# Altium schematic sheet 20 PCIE BRIDGE POWER.SchDoc
size 420 x 297 mm
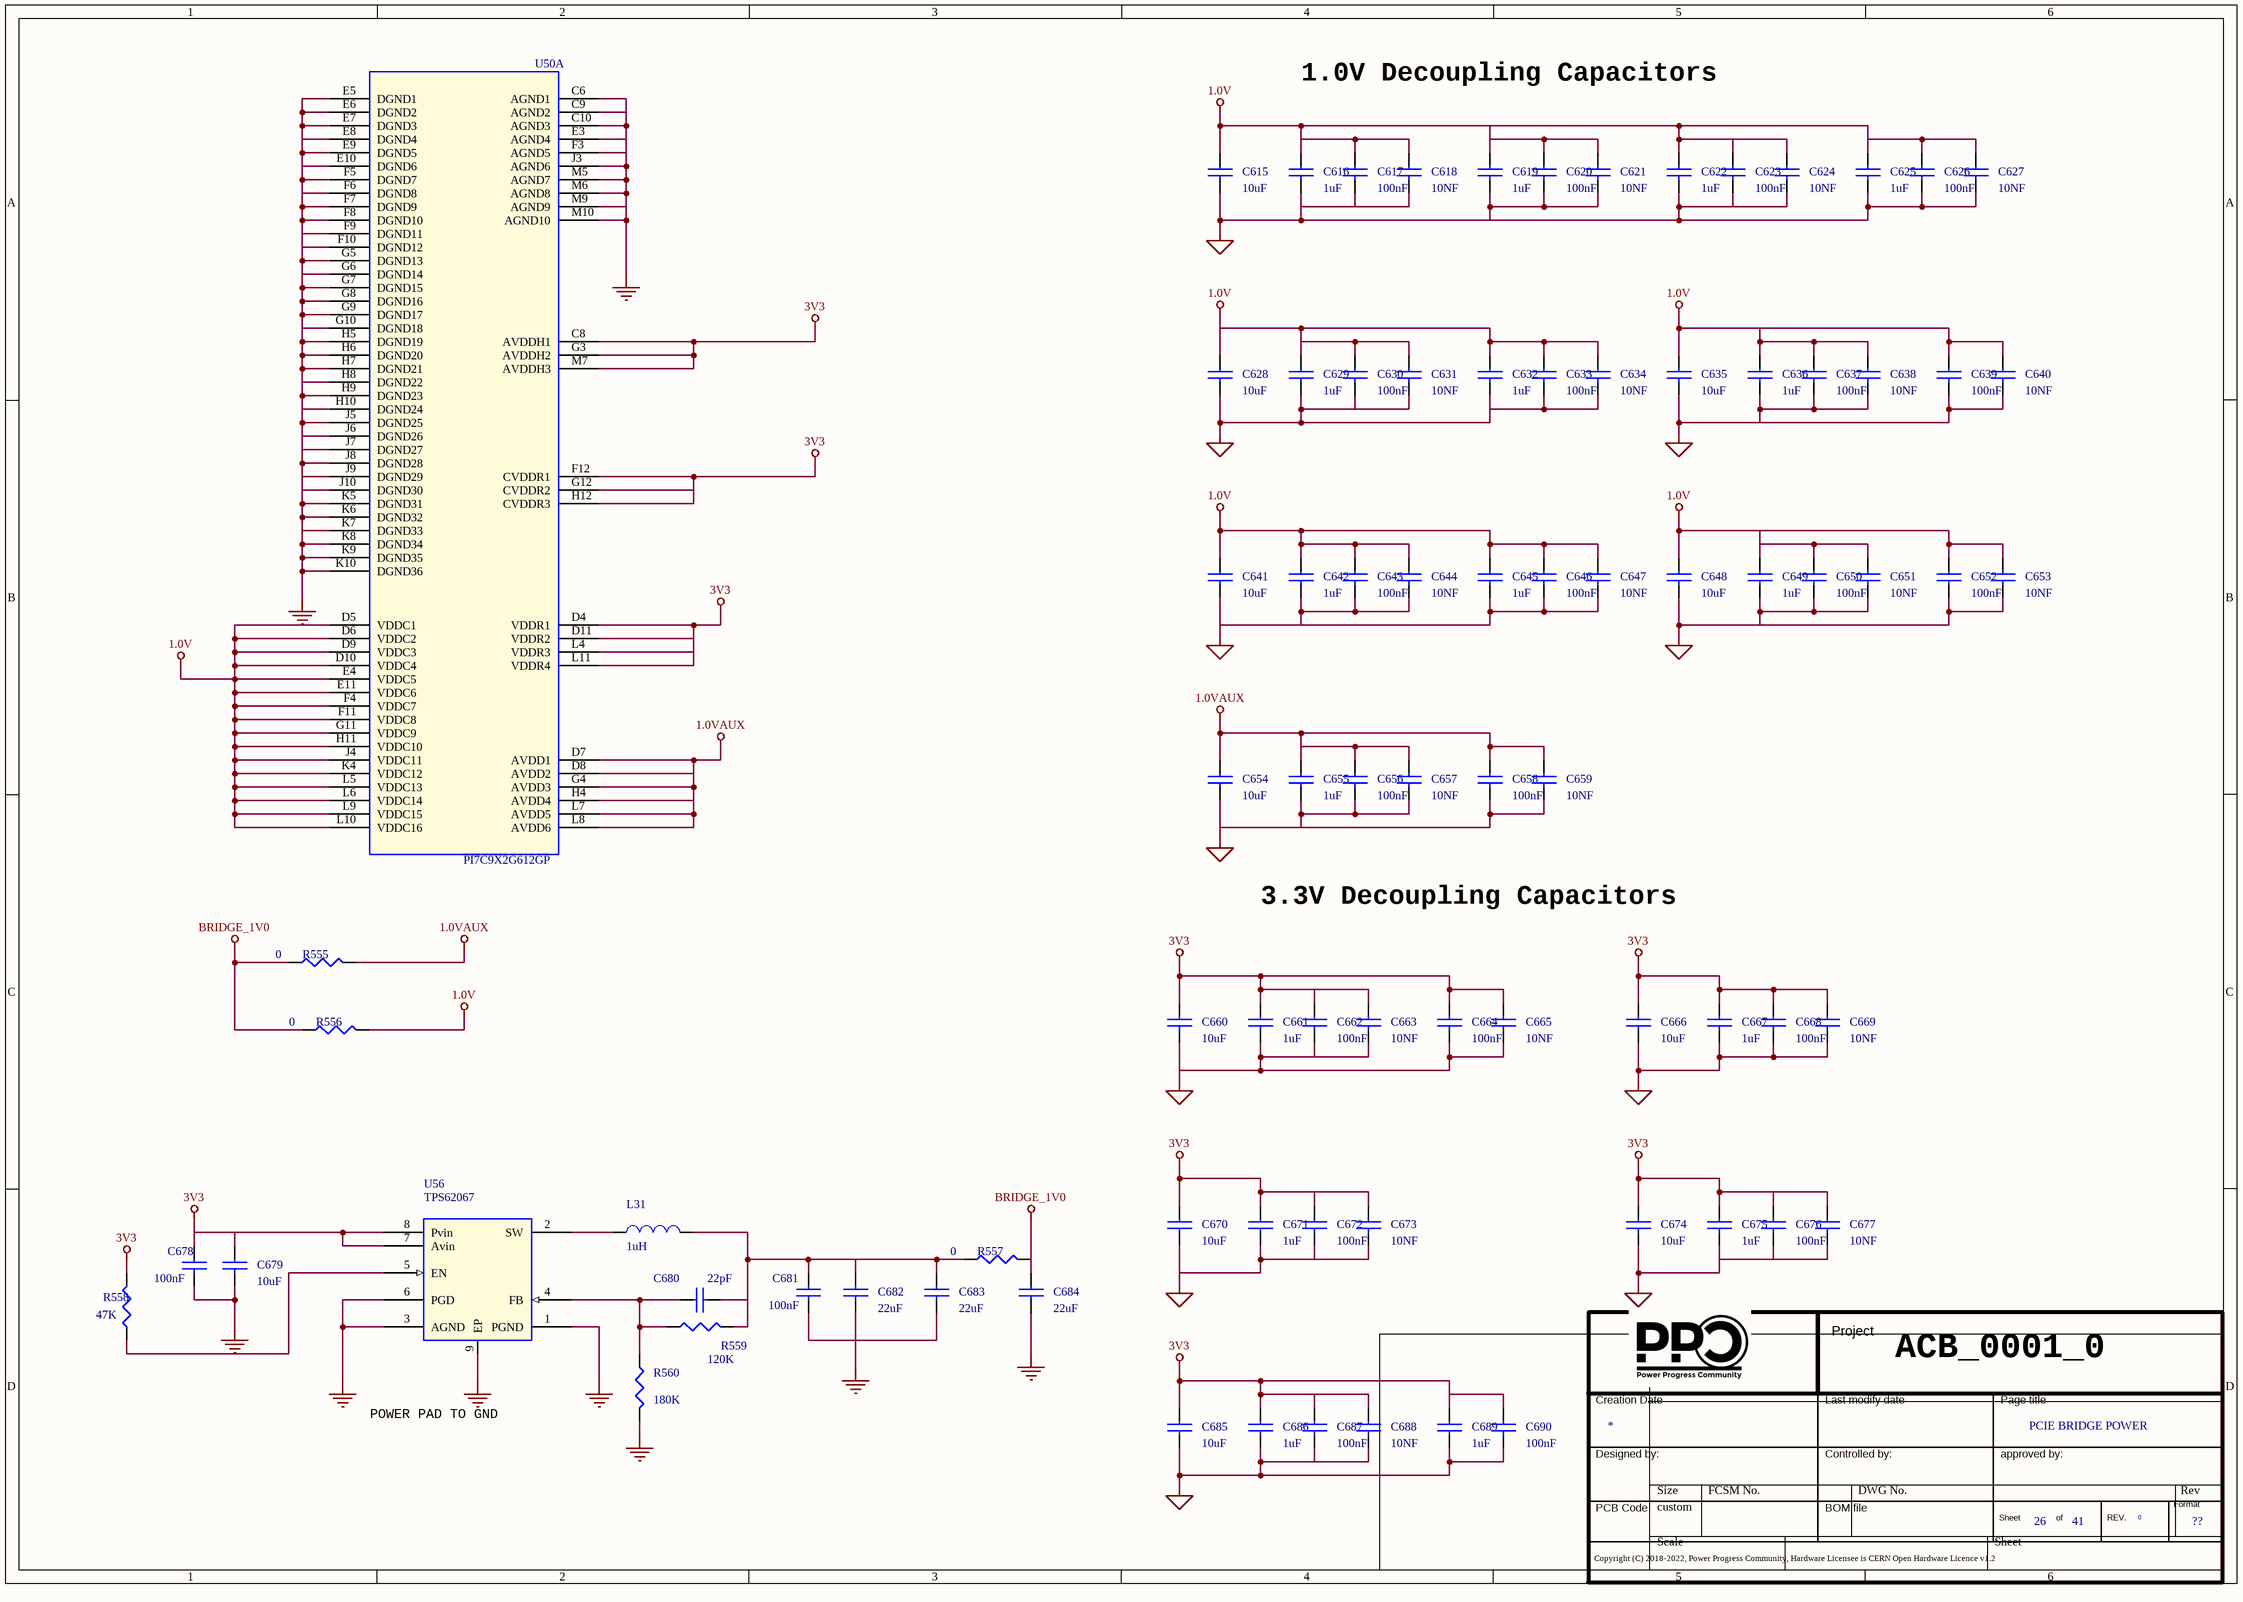
[diagram p0: 20 PCIE BRIDGE POWER.SchDoc]

## Parts
*  Doc: PCIE BRIDGE POWER  Page Count: 41  Page Number: 26  Page Size: ??  RevCode: 0  (hidden comment: Title_block_PPC)  (graphical)
C615  10uF  [SMD_0603]
C616  1uF  [SMD_0402]
C617  100nF  [SMD_0201]
C618  10NF  [SMD_0402]
C619  1uF  [SMD_0402]
C620  100nF  [SMD_0201]
C621  10NF  [SMD_0402]
C622  1uF  [SMD_0402]
C623  100nF  [SMD_0201]
C624  10NF  [SMD_0402]
C625  1uF  [SMD_0402]
C626  100nF  [SMD_0201]
C627  10NF  [SMD_0402]
C628  10uF  [SMD_0603]
C629  1uF  [SMD_0402]
C630  100nF  [SMD_0201]
C631  10NF  [SMD_0402]
C632  1uF  [SMD_0402]
C633  100nF  [SMD_0201]
C634  10NF  [SMD_0402]
C635  10uF  [SMD_0603]
C636  1uF  [SMD_0402]
C637  100nF  [SMD_0201]
C638  10NF  [SMD_0402]
C639  100nF  [SMD_0201]
C640  10NF  [SMD_0402]
C641  10uF  [SMD_0603]
C642  1uF  [SMD_0402]
C643  100nF  [SMD_0201]
C644  10NF  [SMD_0402]
C645  1uF  [SMD_0402]
C646  100nF  [SMD_0201]
C647  10NF  [SMD_0402]
C648  10uF  [SMD_0603]
C649  1uF  [SMD_0402]
C650  100nF  [SMD_0201]
C651  10NF  [SMD_0402]
C652  100nF  [SMD_0201]
C653  10NF  [SMD_0402]
C654  10uF  [SMD_0603]
C655  1uF  [SMD_0402]
C656  100nF  [SMD_0201]
C657  10NF  [SMD_0402]
C658  100nF  [SMD_0201]
C659  10NF  [SMD_0402]
C660  10uF  [SMD_0603]
C661  1uF  [SMD_0402]
C662  100nF  [SMD_0201]
C663  10NF  [SMD_0402]
C664  100nF  [SMD_0201]
C665  10NF  [SMD_0402]
C666  10uF  [SMD_0603]
C667  1uF  [SMD_0402]
C668  100nF  [SMD_0201]
C669  10NF  [SMD_0402]
C670  10uF  [SMD_0603]
C671  1uF  [SMD_0402]
C672  100nF  [SMD_0201]
C673  10NF  [SMD_0402]
C674  10uF  [SMD_0603]
C675  1uF  [SMD_0402]
C676  100nF  [SMD_0201]
C677  10NF  [SMD_0402]
C678  100nF  [SMD_0402]
C679  10uF  [SMD_0603]
C680  22pF  [SMD_0402]
C681  100nF  [SMD_0402]
C682  22uF  [SMD_0805]
C683  22uF  [SMD_0805]
C684  22uF  [SMD_0805]
C685  10uF  [SMD_0603]
C686  1uF  [SMD_0402]
C687  100nF  [SMD_0201]
C688  10NF  [SMD_0402]
C689  1uF  [SMD_0402]
C690  100nF  [SMD_0201]
L31  1uH  [Ind_2016]
R555  0  [SMD_0402]
R556  0  [SMD_0402]
R557  0  [SMD_0402]
R558  47K  [SMD_0402]
R559  120K  [SMD_0402]
R560  180K  [SMD_0402]
U50  PI7C9X2G612GP  [LQFP]  (part A of 3)
U56  TPS62067  [WSON8]

## Nets
1.0V: C615.1 C616.1 C617.1 C618.1 C619.1 C620.1 C621.1 C622.1 C623.1 C624.1 C625.1 C626.1 C627.1 C628.1 C629.1 C630.1 C631.1 C632.1 C633.1 C634.1 C635.1 C636.1 C637.1 C638.1 C639.1 C640.1 C641.1 C642.1 C643.1 C644.1 C645.1 C646.1 C647.1 C648.1 C649.1 C650.1 C651.1 C652.1 C653.1 R556.2 U50.D5(VDDC1) U50.D6(VDDC2) U50.D9(VDDC3) U50.D10(VDDC4) U50.E4(VDDC5) U50.E11(VDDC6) U50.F4(VDDC7) U50.F11(VDDC8) U50.G11(VDDC9) U50.H11(VDDC10) U50.J4(VDDC11) U50.K4(VDDC12) U50.L5(VDDC13) U50.L6(VDDC14) U50.L9(VDDC15) U50.L10(VDDC16)
1.0VAUX: C654.1 C655.1 C656.1 C657.1 C658.1 C659.1 R555.2 U50.D7(AVDD1) U50.D8(AVDD2) U50.G4(AVDD3) U50.H4(AVDD4) U50.L7(AVDD5) U50.L8(AVDD6)
3V3: C660.1 C661.1 C662.1 C663.1 C664.1 C665.1 C666.1 C667.1 C668.1 C669.1 C670.1 C671.1 C672.1 C673.1 C674.1 C675.1 C676.1 C677.1 C678.1 C679.1 C685.1 C686.1 C687.1 C688.1 C689.1 C690.1 R558.1 U50.C8(AVDDH1) U50.D4(VDDR1) U50.D11(VDDR2) U50.F12(CVDDR1) U50.G3(AVDDH2) U50.G12(CVDDR2) U50.H12(CVDDR3) U50.L4(VDDR3) U50.L11(VDDR4) U50.M7(AVDDH3) U56.7(Avin) U56.8(Pvin)
BRIDGE_1V0: C684.1 R555.1 R556.1 R557.2
GND: C615.2 C616.2 C617.2 C618.2 C619.2 C620.2 C621.2 C622.2 C623.2 C624.2 C625.2 C626.2 C627.2 C628.2 C629.2 C630.2 C631.2 C632.2 C633.2 C634.2 C635.2 C636.2 C637.2 C638.2 C639.2 C640.2 C641.2 C642.2 C643.2 C644.2 C645.2 C646.2 C647.2 C648.2 C649.2 C650.2 C651.2 C652.2 C653.2 C654.2 C655.2 C656.2 C657.2 C658.2 C659.2 C660.2 C661.2 C662.2 C663.2 C664.2 C665.2 C666.2 C667.2 C668.2 C669.2 C670.2 C671.2 C672.2 C673.2 C674.2 C675.2 C676.2 C677.2 C678.2 C679.2 C681.2 C682.2 C683.2 C684.2 C685.2 C686.2 C687.2 C688.2 C689.2 C690.2 R560.2 U50.C6(AGND1) U50.C9(AGND2) U50.C10(AGND3) U50.E3(AGND4) U50.E5(DGND1) U50.E6(DGND2) U50.E7(DGND3) U50.E8(DGND4) U50.E9(DGND5) U50.E10(DGND6) U50.F3(AGND5) U50.F5(DGND7) U50.F6(DGND8) U50.F7(DGND9) U50.F8(DGND10) U50.F9(DGND11) U50.F10(DGND12) U50.G5(DGND13) U50.G6(DGND14) U50.G7(DGND15) U50.G8(DGND16) U50.G9(DGND17) U50.G10(DGND18) U50.H5(DGND19) U50.H6(DGND20) U50.H7(DGND21) U50.H8(DGND22) U50.H9(DGND23) U50.H10(DGND24) U50.J3(AGND6) U50.J5(DGND25) U50.J6(DGND26) U50.J7(DGND27) U50.J8(DGND28) U50.J9(DGND29) U50.J10(DGND30) U50.K5(DGND31) U50.K6(DGND32) U50.K7(DGND33) U50.K8(DGND34) U50.K9(DGND35) U50.K10(DGND36) U50.M5(AGND7) U50.M6(AGND8) U50.M9(AGND9) U50.M10(AGND10) U56.1(PGND) U56.3(AGND) U56.6(PGD) U56.9(EP)
NetC680_1: C680.1 R559.1 R560.1 U56.4(FB)
NetC680_2: C680.2 C681.1 C682.1 C683.1 L31.2 R557.1 R559.2
NetL31_1: L31.1 U56.2(SW)
NetR558_2: R558.2 U56.5(EN)

## Notes on the sheet
- 1.0V Decoupling Capacitors
- 3.3V Decoupling Capacitors
- ACB_0001_0
- POWER PAD TO GND
- (in symbol Title_block_PPC) Project; Creation Date; Last modify date; Page title; Designed by:; Controlled by:; approved by:; Format; PCB Code; BOM file; Sheet; of; REV.; Copyright (C) 2018-2022, Power Progress Community, Hardware Licensee is CERN Open Hardware Licence v1.2

## Library data of the parts
* = Title_block_PPC: Title: T2080PCIe; Author: MICETEK; Page Create Date: March  8, 1995; Page Title: ?; Page Modify Date: *
C615 C628 C635 C641 C648 C654 C660 C666 C670 C674 C685 = CAP NP_Dup3: COND.CER.10uF 0603 25V SMD; Manufacturer Part Number 1: CL10A106MA8NRNC; Manufacturer 1: SAMSUNG; Part Number: PASSIVE_124; RSM: RC0603; PCB Footprint: SMD_0603; Part Type: Capacitors\Ceramic\SMD\0603
C616 C619 C622 C625 C629 C632 C636 C642 C645 C649 C655 C661 C667 C671 C675 C686 C689 = CAP NP_Dup3: CAP CER 1UF 25V X6S 0402; Manufacturer Part Number 1: GRM155C81E105KE11D; Manufacturer 1: Murata; Part Number: PASSIVE_1446; RSM: RC0402; PCB Footprint: SMD_0402; Part Type: Capacitors\Ceramic\SMD\0402
C617 C620 C623 C626 C630 C633 C637 C639 C643 C646 C650 C652 C656 C658 C662 C664 C668 C672 C676 C687 C690 = CAP NP_Dup3: CAP CER 0.1UF 6.3V 20% X5R 0201; Part Number: PASSIVE_3; Manufacturer 1: TDK; Manufacturer Part Number 1: C0603X5R0J104M030BC; RSM: RC0201; Part Type: Capacitors\Ceramic\SMD\0201; PCB Footprint: SMD_0201
C618 C621 C624 C627 C631 C634 C638 C640 C644 C647 C651 C653 C657 C659 C663 C665 C669 C673 C677 C688 = CAP NP_Dup3: COND.CER. 10NF 16V 0402 X7R SMD; Part Number: PASSIVE_28; Manufacturer 1: AVX; Manufacturer Part Number 1: 0402YC103KAT2A; RSM: RC0402; Part Type: Capacitors\Ceramic\SMD\0402; PCB Footprint: SMD_0402
C678 = CAP NP_Dup10: COND.CER. 100NF 50V 0402 X7R SMD; LNK_PART: C0402X55; Part Number: PASSIVE_24; Manufacturer 1: TDK; Manufacturer Part Number 1: CGA2B3X7R1H104M050BD; Tecno77: RC0402; PCB Footprint: SMD_0402; Part Type: Capacitors\Ceramic\SMD\0402; Distributor 1: MURATA ELETTRONICA SPA; RSM: RC0402
C679 = CAP NP_Dup4: COND.CER.10uF 0603 25V SMD; Part Number: PASSIVE_124; Manufacturer 1: SAMSUNG; Manufacturer Part Number 1: CL10A106MA8NRNC; LNK_PART: GRM188R60J106ME47D; RSM: RC0603; PCB Footprint: SMD_0603; Part Type: Capacitors\Ceramic\SMD\0603; Distributor 1: MOUSER (81-GRM188R60J106ME47)
C680 = CAP NP_Dup10: COND.CER. 22PF 50V 0402 NPO 5% SMD; Part Number: PASSIVE_65; Manufacturer 1: Murata; Manufacturer Part Number 1: GRM1555C1H220JZ01; RSM: RC0402; PCB Footprint: SMD_0402; Part Type: Capacitors\Ceramic\SMD\0402; Distributor 1: MURATA ELETTRONICA SPA
C681 = CAP NP_Dup10: COND.CER. 100NF 50V 0402 X7R SMD; Manufacturer Part Number 1: CGA2B3X7R1H104M050BD; Manufacturer 1: TDK; Part Number: PASSIVE_24; LNK_PART: C0402X55; RSM: RC0402; PCB Footprint: SMD_0402; Tecno77: RC0402; Distributor 1: MURATA ELETTRONICA SPA; Part Type: Capacitors\Ceramic\SMD\0402
C682-C684 = CAP NP_Dup3: 22UF 35V 20% 0805; Manufacturer Part Number 1: C2012X5R1V226M125AC; Manufacturer 1: TDK; Part Number: PASSIVE_224; RSM: RC0805; PCB Footprint: SMD_0805; Part Type: Capacitors\Ceramic\SMD\0805
L31 = INDUCTOR: Induttori fissi 1.0uH 2.08A 68mOhms Pwr Circuit Inductor; Manufacturer Part Number 1: VLS201612CX-1R0M; Manufacturer 1: TDK; Part Number: PASSIVE_424; RSM: IND-TDK-VLS-2016; Distributor 1: MOUSER(810-VLS201612CX-1R0M  ); Part Type: Inductors\SMD; PCB Footprint: Ind_2016
R555 = R_Dup5: RESIS.CHIP 0R 5% 0402 SMD; LNK_PART: R0402X55; Manufacturer 1: ROYAL OHM; Part Number: PASSIVE_805; RSM: RC0402; PCB Footprint: SMD_0402; Distributor 1: CAMEL ELETTRONICA SRL  #; Manufacturer Part Number 1: RESIS.CHIP 0R 5% 0402 SMD; Part Type: Resistors\Fixed\SMD\0402\5%
R556 R557 = R_Dup5: RESIS.CHIP 0R 5% 0402 SMD; Part Number: PASSIVE_805; Manufacturer 1: ROYAL OHM; LNK_PART: R0402X55; RSM: RC0402; PCB Footprint: SMD_0402; Part Type: Resistors\Fixed\SMD\0402\5%; Manufacturer Part Number 1: RESIS.CHIP 0R 5% 0402 SMD; Distributor 1: CAMEL ELETTRONICA SRL  #
R558 = R_Dup5: RESIS.CHIP 47K 1% 0402 SMD; Part Number: PASSIVE_737; Manufacturer 1: ROYAL OHM; LNK_PART: R0402X55; Tecno77: RC0402; PCB Footprint: SMD_0402; Part Type: Resistors\Fixed\SMD\0402\1%; Manufacturer Part Number 1: RESIS.CHIP 47K 1% 0402 SMD; Distributor 1: CAMEL ELETTRONICA SRL  #; RSM: RC0402
R559 = R_Dup9: RESIS.CHIP 120K 1% 0402 SMD; Part Number: PASSIVE_593; Manufacturer 1: WALSIN; Manufacturer Part Number 1: WR04W1203FTL; RSM: RC0402; PCB Footprint: SMD_0402; Part Type: Resistors\Fixed\SMD\0402\1%; Distributor 1: MODULI ELETTRONICI E COMPONENTI spa
R560 = R_Dup9: RESIS.CHIP 180K 1% 0402 SMD; Manufacturer 1: ROYAL OHM; Part Number: PASSIVE_624; RSM: RC0402; PCB Footprint: SMD_0402; Distributor 1: CAMEL ELETTRONICA SRL  #; Manufacturer Part Number 1: RESIS.CHIP 180K 1% 0402 SMD; Part Type: Resistors\Fixed\SMD\0402\1%
U50 = PI7C9X2G612GP: PCI 6 Ports 6Lanes PCIE2 Packet Switch; Manufacturer Part Number 1: PI7C9X2G612GPCNJE; Manufacturer 1: DIODES; Part Number: LOGIC_342; PCB Footprint: LBGA_196; RSM: LGA-196-15X15; Distributor 1: MOUSER( 729-PI7C9X2G612GPCNJ ); Part Type: PCIE\SWITCH
U56 = TPS62067: IC REG BUCK SYNC ADJ 2A 8WSON; Part Number: LINEAR_251; Manufacturer 1: TEXAS; Manufacturer Part Number 1: TPS62067DSGT; RSM: WSON-8-2_1X2_1; PCB Footprint: WSON8; Part Type: Regulators\Switching; Distributor 1: DIGIKEY (296-27205-1-ND)